# EAGLE design Main (EAGLE 7.2.0)
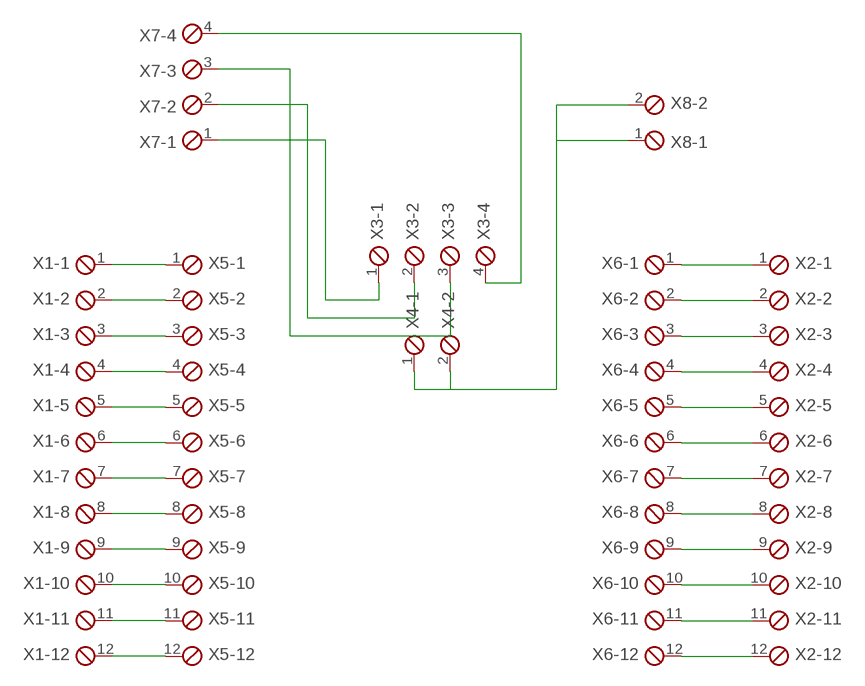
[diagram p0: schematic, sheet 1]

## Parts
X1  MPT12  [12POL254]
X2  MPT12  [12POL254]
X3  MPT4  [4POL254]
X4  MPT2  [2POL254]
X5  MPT12  [12POL254]
X6  MPT12  [12POL254]
X7  MPT4  [4POL254]
X8  MPT2  [2POL254]

## Nets
N$1: X1.1 X5.1
N$2: X1.2 X5.2
N$3: X1.3 X5.3
N$4: X1.4 X5.4
N$5: X1.5 X5.5
N$6: X1.6 X5.6
N$7: X1.7 X5.7
N$8: X1.8 X5.8
N$9: X1.9 X5.9
N$10: X1.10 X5.10
N$11: X1.11 X5.11
N$12: X1.12 X5.12
N$13: X2.1 X6.1
N$14: X2.2 X6.2
N$15: X2.3 X6.3
N$16: X2.4 X6.4
N$17: X2.5 X6.5
N$18: X2.6 X6.6
N$19: X2.7 X6.7
N$20: X2.8 X6.8
N$21: X2.9 X6.9
N$22: X2.10 X6.10
N$23: X2.11 X6.11
N$24: X2.12 X6.12
N$25: X3.1 X7.1
N$26: X3.2 X7.2
N$27: X3.3 X7.3
N$28: X3.4 X7.4
N$29: X4.1 X4.2 X8.1 X8.2

## Library data of the parts
X1 X2 X5 X6 = con-phoenix-254:MPT12: PHOENIX CONNECTOR; OC_FARNELL: unknown; OC_NEWARK: unknown
X3 X7 = con-phoenix-254:MPT4: PHOENIX CONNECTOR; OC_FARNELL: unknown; OC_NEWARK: unknown
X4 X8 = con-phoenix-254:MPT2: PHOENIX CONNECTOR; OC_FARNELL: unknown; OC_NEWARK: unknown

## Net classes
0 default: width 0.005 mm

## Board
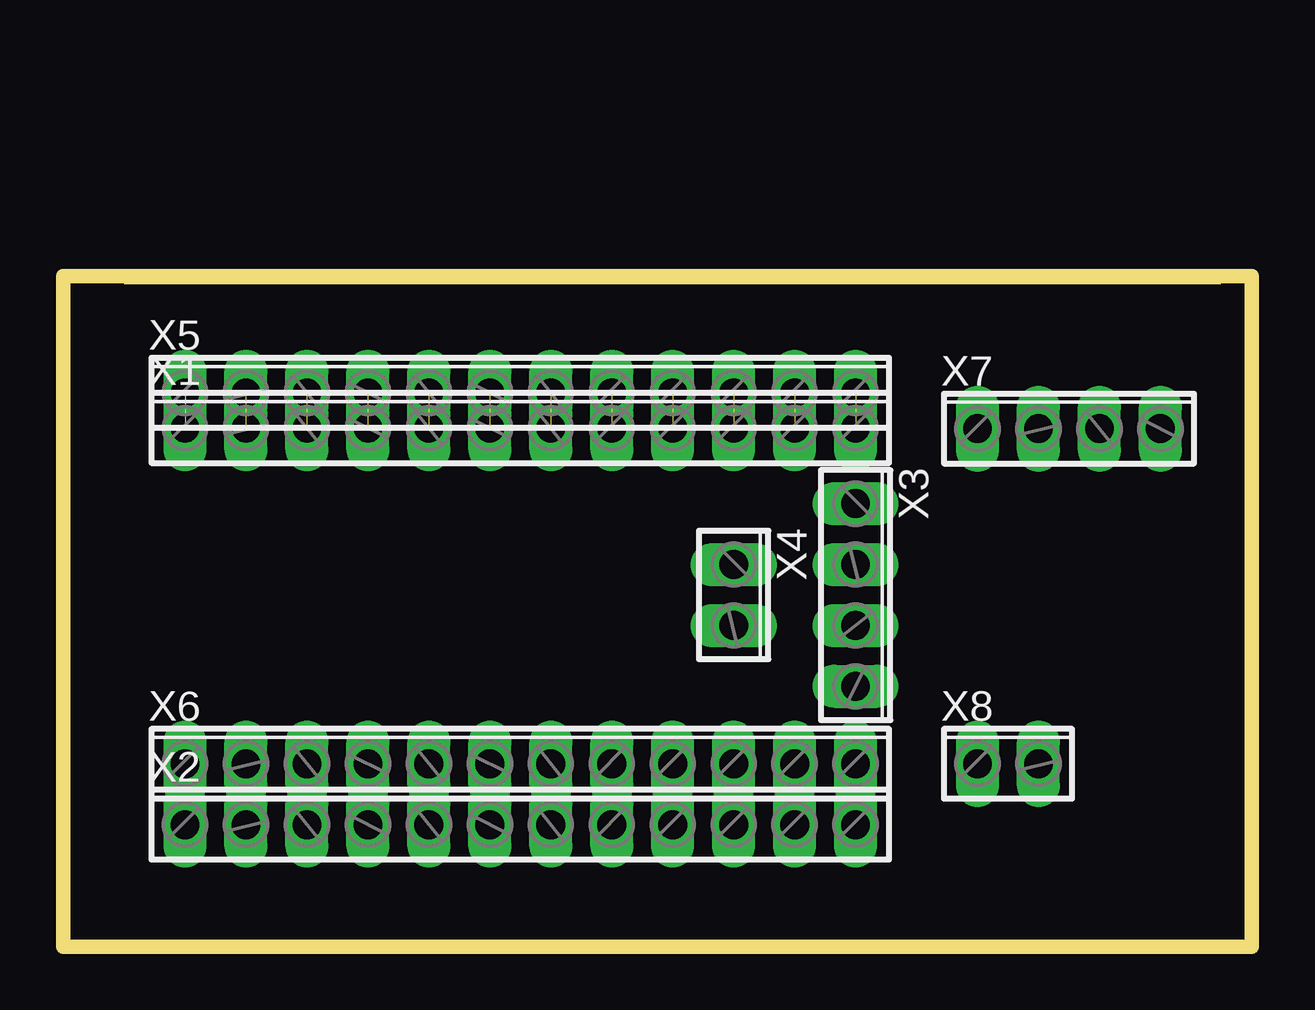
[diagram p1: board, top side]
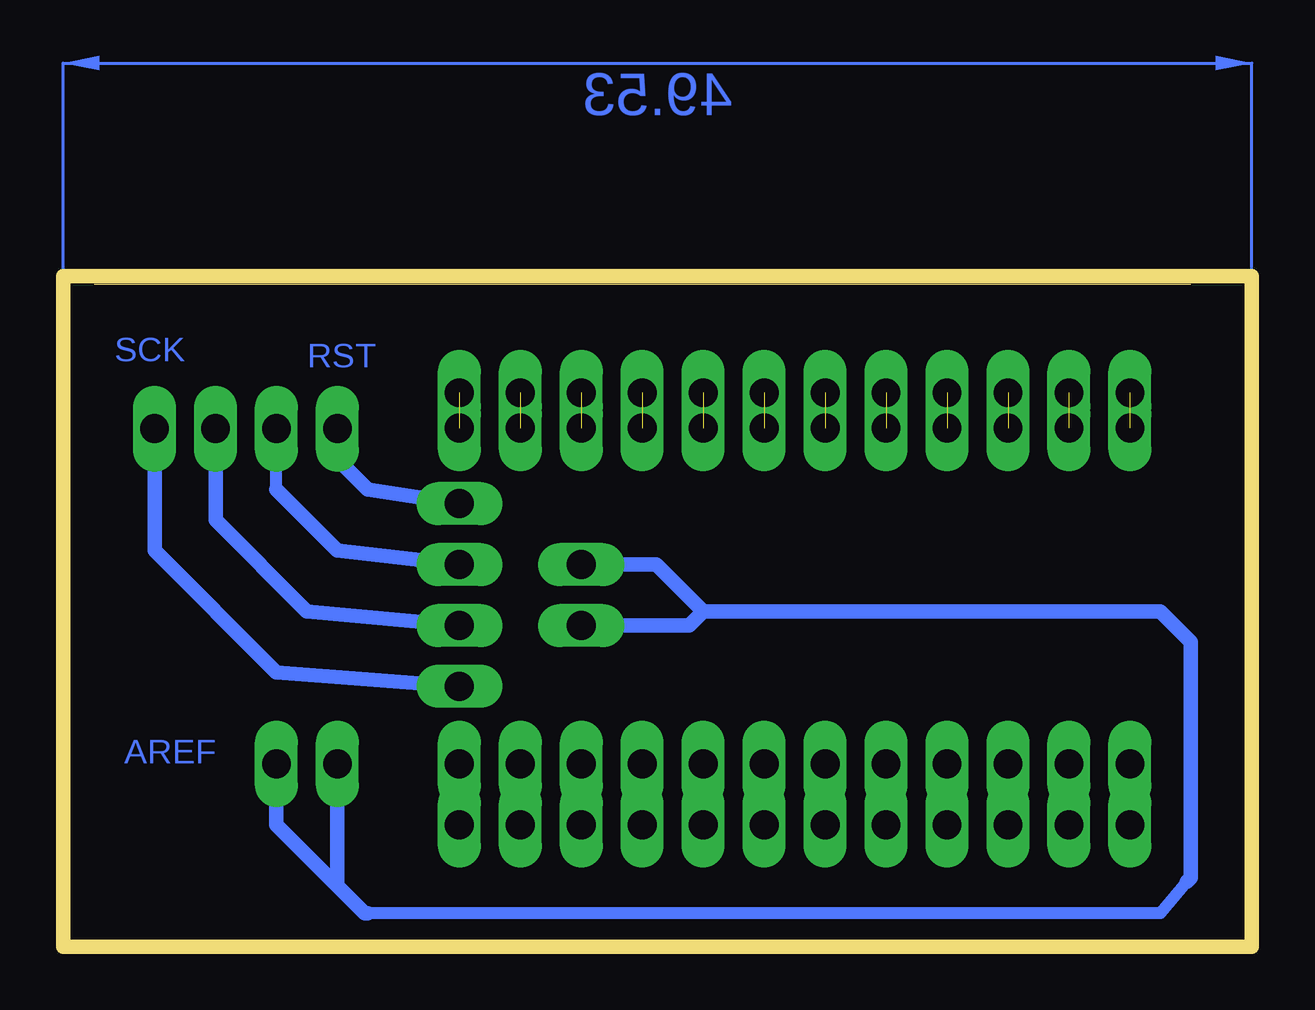
[diagram p2: board, bottom side, seen from below]

Size 49.53 x 27.94 mm. Coordinates in mm from the lower left corner, seen from the top.
Outline: 48.24,27.61 2.54,27.61
Outline: 0,27.94 49.53,27.94 49.53,0 0,0 0,27.94
Copper layers (1*16): Top 0.035mm / dielectric 1.5mm / Bottom 0.035mm
Design rules "default": minimum track width 10mil, minimum drill 24mil, track to track 8mil, track to pad 8mil, pad to pad 8mil, via to via 8mil, smd to smd 8mil, copper to edge 40mil, drill to drill 8mil, minimum pad ring 10mil, minimum via ring 8mil, stop-mask expansion 4mil, vias tented up to drill 0mil, thermal gap 10mil

### Footprints (pad centres in the part's own frame; a part is rotated, then mirrored left to right if it is on the bottom)
12POL254 = drill 1.2 long: 1 -13.97,0; 2 -11.43,0; 3 -8.89,0; 4 -6.35,0; 5 -3.81,0; 6 -1.27,0; 7 1.27,0; 8 3.81,0; 9 6.35,0; 10 8.89,0; 11 11.43,0; 12 13.97,0
4POL254 = drill 1.2 long: 1 -3.81,0; 2 -1.27,0; 3 1.27,0; 4 3.81,0
2POL254 = drill 1.2 long: 1 -1.27,0; 2 1.27,0

### Placement (x,y rotation side)
X1  19.05,21.62 0 top
X2  19.05,5.08 0 top
X3  33.02,14.66 270 top
X4  27.94,14.66 270 top
X5  19.05,23.09 0 top
X6  19.05,7.62 0 top
X7  41.91,21.59 0 top
X8  39.37,7.62 0 top

### Tracks (layer width: path | path; a pad name or v marks a point on that pad's centre or on a via)
N$1  (1 unrouted)
N$2  (1 unrouted)
N$3  (1 unrouted)
N$4  (1 unrouted)
N$5  (1 unrouted)
N$6  (1 unrouted)
N$7  (1 unrouted)
N$8  (1 unrouted)
N$9  (1 unrouted)
N$10  (1 unrouted)
N$11  (1 unrouted)
N$12  (1 unrouted)
N$13
  Bottom 0.61: X6.1 X2.1
N$14
  Bottom 0.61: X6.2 X2.2
N$15
  Bottom 0.61: X6.3 X2.3
N$16
  Bottom 0.61: X6.4 X2.4
N$17
  Bottom 0.61: X6.5 X2.5
N$18
  Bottom 0.61: X6.6 X2.6
N$19
  Bottom 0.61: X6.7 X2.7
N$20
  Bottom 0.61: X6.8 X2.8
N$21
  Bottom 0.61: X6.9 X2.9
N$22
  Bottom 0.61: X6.10 X2.10
N$23
  Bottom 0.61: X6.11 X2.11
N$24
  Bottom 0.61: X6.12 X2.12
N$25
  Bottom 0.61: X3.1 36.83,19.05 38.1,20.32 X7.1
N$26
  Bottom 0.508: 40.64,19.05 X7.2
  Bottom 0.61: X3.2 38.1,16.51 40.64,19.05
N$27
  Bottom 0.61: X3.3 39.37,13.97 43.18,17.78 X7.3
N$28
  Bottom 0.61: X3.4 40.64,11.43 45.72,16.51 X7.4
N$29
  Bottom 0.254: 38.1,2.54 36.83,1.27
  Bottom 0.508: 2.72,2.69 3.81,1.4 36.83,1.4
  Bottom 0.61: X4.1 24.82,15.93 22.86,13.97 | 22.86,13.97 3.81,13.97 2.54,12.7 2.54,2.87 2.72,2.69 | X4.2 23.44,13.39 22.86,13.97 | 36.83,1.4 36.96,1.4 38.1,2.54 | X8.2 40.64,5.08 38.1,2.54 | 38.1,2.54 X8.1
(copper drawn outside any net)
  shapes: Bottom area x2

### Text on the board
Bottom: SCK | RST | AREF